# Altium schematic sheet camera.SchDoc: Camera Schematic
size A; DrawnBy: Mike Mozingo; Engineer: Mike Mozingo; Revision: 2; DocumentName: Camera Schematic
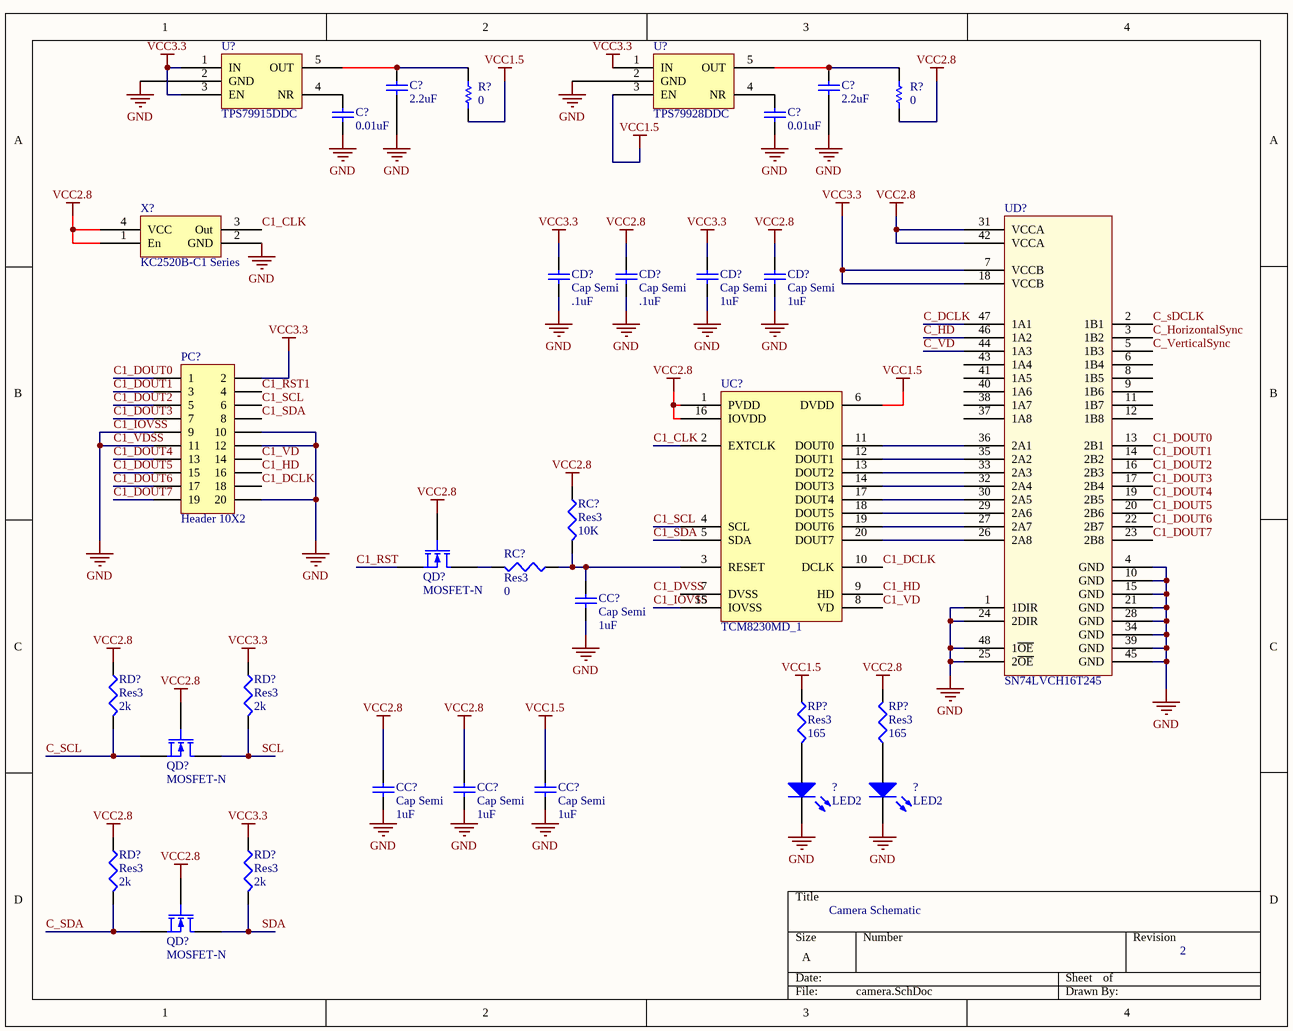
[diagram p0: camera.SchDoc]

## Parts
(Parts that share a designator on the sheet are numbered #1, #2 ... from top to bottom, then left to right.)
?#1  LED2  [DIODE1608]
?#2  LED2  [DIODE1608]
C?#1  value 2.2uF  [CAPC1608L]  (hidden comment: Cap Semi)
C?#2  value 2.2uF  [CAPC1608L]  (hidden comment: Cap Semi)
C?#3  value 0.01uF  [CAPC1608L]  (hidden comment: Cap Semi)
C?#4  value 0.01uF  [CAPC1608L]  (hidden comment: Cap Semi)
CC?#1  Cap Semi  value 1uF  [CAPC1608L]
CC?#2  Cap Semi  value 1uF  [CAPC1608L]
CC?#3  Cap Semi  value 1uF  [CAPC1608L]
CC?#4  Cap Semi  value 1uF  [CAPC1608L]
CD?#1  Cap Semi  value .1uF  [CAPC1608L]
CD?#2  Cap Semi  value .1uF  [CAPC1608L]
CD?#3  Cap Semi  value 1uF  [CAPC1608L]
CD?#4  Cap Semi  value 1uF  [CAPC1608L]
PC?  Header 10X2  [HDR2X10]
QD?#1  MOSFET-N  [SOT95P240-3N]
QD?#2  MOSFET-N  [SOT95P240-3N]
QD?#3  MOSFET-N  [SOT95P240-3N]
R?#1  value 0  [RESC1608L]  (hidden comment: Res Semi)
R?#2  value 0  [RESC1608L]  (hidden comment: Res Semi)
RC?#1  Res3  value 10K  [RESC1608L]
RC?#2  Res3  value 0  [RESC1608L]
RD?#1  Res3  value 2k  [RESC1608L]
RD?#2  Res3  value 2k  [RESC1608L]
RD?#3  Res3  value 2k  [RESC1608L]
RD?#4  Res3  value 2k  [RESC1608L]
RP?#1  Res3  value 165  [RESC1608L]
RP?#2  Res3  value 165  [RESC1608L]
U?#1  TPS79915DDC  [TSOT23-5]
U?#2  TPS79928DDC  [TSOT23-5]
UC?  TCM8230MD_1  [TCM8230MD]
UD?  SN74LVCH16T245  [SN74LVCH16T245]
X?  KC2520B-C1 Series  [KC2520B-C1]

## Nets
C1_IOVSS: ?#1.2(K) ?#2.2(K) C?#1.2 C?#2.2 C?#3.2 C?#4.2 CC?#1.1 CC?#2.1 CC?#3.1 CC?#4.1 CD?#1.1 CD?#2.1 CD?#3.1 CD?#4.1 PC?.9 PC?.10 PC?.11 PC?.12 PC?.20 U?#1.2(GND) U?#2.2(GND) UC?.15(IOVSS) UD?.1(1DIR) UD?.4(GND) UD?.10(GND) UD?.15(GND) UD?.21(GND) UD?.24(2DIR) UD?.25(2~{OE}) UD?.28(GND) UD?.34(GND) UD?.39(GND) UD?.45(GND) UD?.48(1~{OE}) X?.2(GND)  [also labelled C1_VDSS, GND]
VCC1.5: CC?#4.2 R?#1.2 RP?#1.1 U?#2.3(EN) UC?.6(DVDD)
VCC2.8: CC?#2.2 CC?#3.2 CD?#2.2 CD?#4.2 QD?#1.2(G) QD?#2.2(G) QD?#3.2(G) R?#2.2 RC?#1.2 RD?#1.1 RD?#3.1 RP?#2.2 UC?.1(PVDD) UC?.16(IOVDD) UD?.31(VCCA) UD?.42(VCCA) X?.1(En) X?.4(VCC)
VCC3.3: CD?#1.2 CD?#3.2 PC?.2 RD?#2.1 RD?#4.1 U?#1.1(IN) U?#1.3(EN) U?#2.1(IN) UD?.7(VCCB) UD?.18(VCCB)
C1_CLK: UC?.2(EXTCLK) X?.3(Out)
C1_DCLK: PC?.18 UC?.10(DCLK)
C1_DOUT0: PC?.1 UD?.13(2B1)
C1_DOUT1: PC?.3 UD?.14(2B2)
C1_DOUT2: PC?.5 UD?.16(2B3)
C1_DOUT3: PC?.7 UD?.17(2B4)
C1_DOUT4: PC?.13 UD?.19(2B5)
C1_DOUT5: PC?.15 UD?.20(2B6)
C1_DOUT6: PC?.17 UD?.22(2B7)
C1_DOUT7: PC?.19 UD?.23(2B8)
C1_HD: PC?.16 UC?.9(HD)
C1_RST: QD?#1.3(S)
C1_RST1: PC?.4
C1_SCL: PC?.6 UC?.4(SCL)
C1_SDA: PC?.8 UC?.5(SDA)
C1_VD: PC?.14 UC?.8(VD)
C_DCLK: UD?.47(1A1)
C_HD: UD?.46(1A2)
C_HorizontalSync: UD?.3(1B2)
C_SCL: QD?#2.3(S) RD?#1.2
C_SDA: QD?#3.3(S) RD?#3.2
C_sDCLK: UD?.2(1B1)
C_VD: UD?.44(1A3)
C_VerticalSync: UD?.5(1B3)
SCL: QD?#2.1(D) RD?#2.2
SDA: QD?#3.1(D) RD?#4.2
Net?#1_1: ?#1.1(A) RP?#1.2
Net?#2_1: ?#2.1(A) RP?#2.1
NetC?#1_1: C?#1.1 R?#1.1 U?#1.5(OUT)
NetC?#2_1: C?#2.1 R?#2.1 U?#2.5(OUT)
NetC?#3_1: C?#3.1 U?#1.4(NR)
NetC?#4_1: C?#4.1 U?#2.4(NR)
NetCC?#1_2: CC?#1.2 RC?#1.1 RC?#2.2 UC?.3(RESET)
NetQD?#1_1: QD?#1.1(D) RC?#2.1
NetUC?_11: UC?.11(DOUT0) UD?.36(2A1)
NetUC?_12: UC?.12(DOUT1) UD?.35(2A2)
NetUC?_13: UC?.13(DOUT2) UD?.33(2A3)
NetUC?_14: UC?.14(DOUT3) UD?.32(2A4)
NetUC?_17: UC?.17(DOUT4) UD?.30(2A5)
NetUC?_18: UC?.18(DOUT5) UD?.29(2A6)
NetUC?_19: UC?.19(DOUT6) UD?.27(2A7)
NetUC?_20: UC?.20(DOUT7) UD?.26(2A8)

Not connected (* = marked no-connect by the designer): UC? 7(DVSS); UD? 6(1B4) 8(1B5) 9(1B6) 11(1B7) 12(1B8) 37(1A8) 38(1A7) 40(1A6) 41(1A5) 43(1A4)

## Notes on the sheet
- Labels drawn without touching a wire or pin: C1_DVSS

## Library data of the parts
?#1 ?#2 = LED2: Typical RED, GREEN, YELLOW, AMBER GaAs LED; Published: 8-Jun-2000; LatestRevisionDate: 17-Jul-2002; LatestRevisionNote: Re-released for DXP Platform.; PackageVersion: Feb-2002; PackageReference: 3.2X1.6X1.1; Publisher: Altium Limited; Color: Blue
C?#1-C?#4 CC?#1-CC?#4 CD?#1-CD?#4 = Cap Semi: Capacitor (Semiconductor SIM Model); Published: 8-Jun-2000; LatestRevisionDate: 29-May-2009; LatestRevisionNote: IPC-7351 Footprint Added.; PackageReference: C1206; Publisher: Altium Limited; PackageDescription: Chip Capacitor
PC? = Header 10X2: Header, 10-Pin, Dual row; LatestRevisionDate: 17-Jul-2002; LatestRevisionNote: Re-released for DXP Platform.; Publisher: Altium Limited
QD?#1-QD?#3 = MOSFET-N: N-Channel MOSFET; Published: 8-Jun-2000; LatestRevisionDate: 17-Jul-2002; LatestRevisionNote: Re-released for DXP Platform.; PackageVersion: 1995/1996; PackageReference: E3; Publisher: Altium Limited
R?#1 R?#2 = Res Semi: Semiconductor Resistor; Published: 8-Jun-2000; LatestRevisionDate: 17-Jul-2002; LatestRevisionNote: Re-released for DXP Platform.; PackageReference: AXIAL-0.5; Publisher: Altium Limited
RC?#1 RC?#2 RD?#1-RD?#4 RP?#1 RP?#2 = Res3: Resistor; Published: 8-Jun-2000; LatestRevisionDate: 29-May-2009; LatestRevisionNote: IPC-7351 Footprint Added.; PackageReference: J1-0603; Publisher: Altium Limited; PackageDescription: Chip Resistor
U?#1 U?#2 = TPS799xxDDC: 200mA, Low Quiescent Current, Ultra-Low Noise, High PSRR  Low Dropout Linear Regulator
UC? = TCM8230MD_1: VGA CAMERA MODULE 640x480
UD? = SN74LVCH16T245: 16-bit bus transceiver with voltage regulation.
X? = KC2520B-C1: Standard Oscillator